# EAGLE design ai_breakout_tb6612fng (EAGLE 6.5.0)
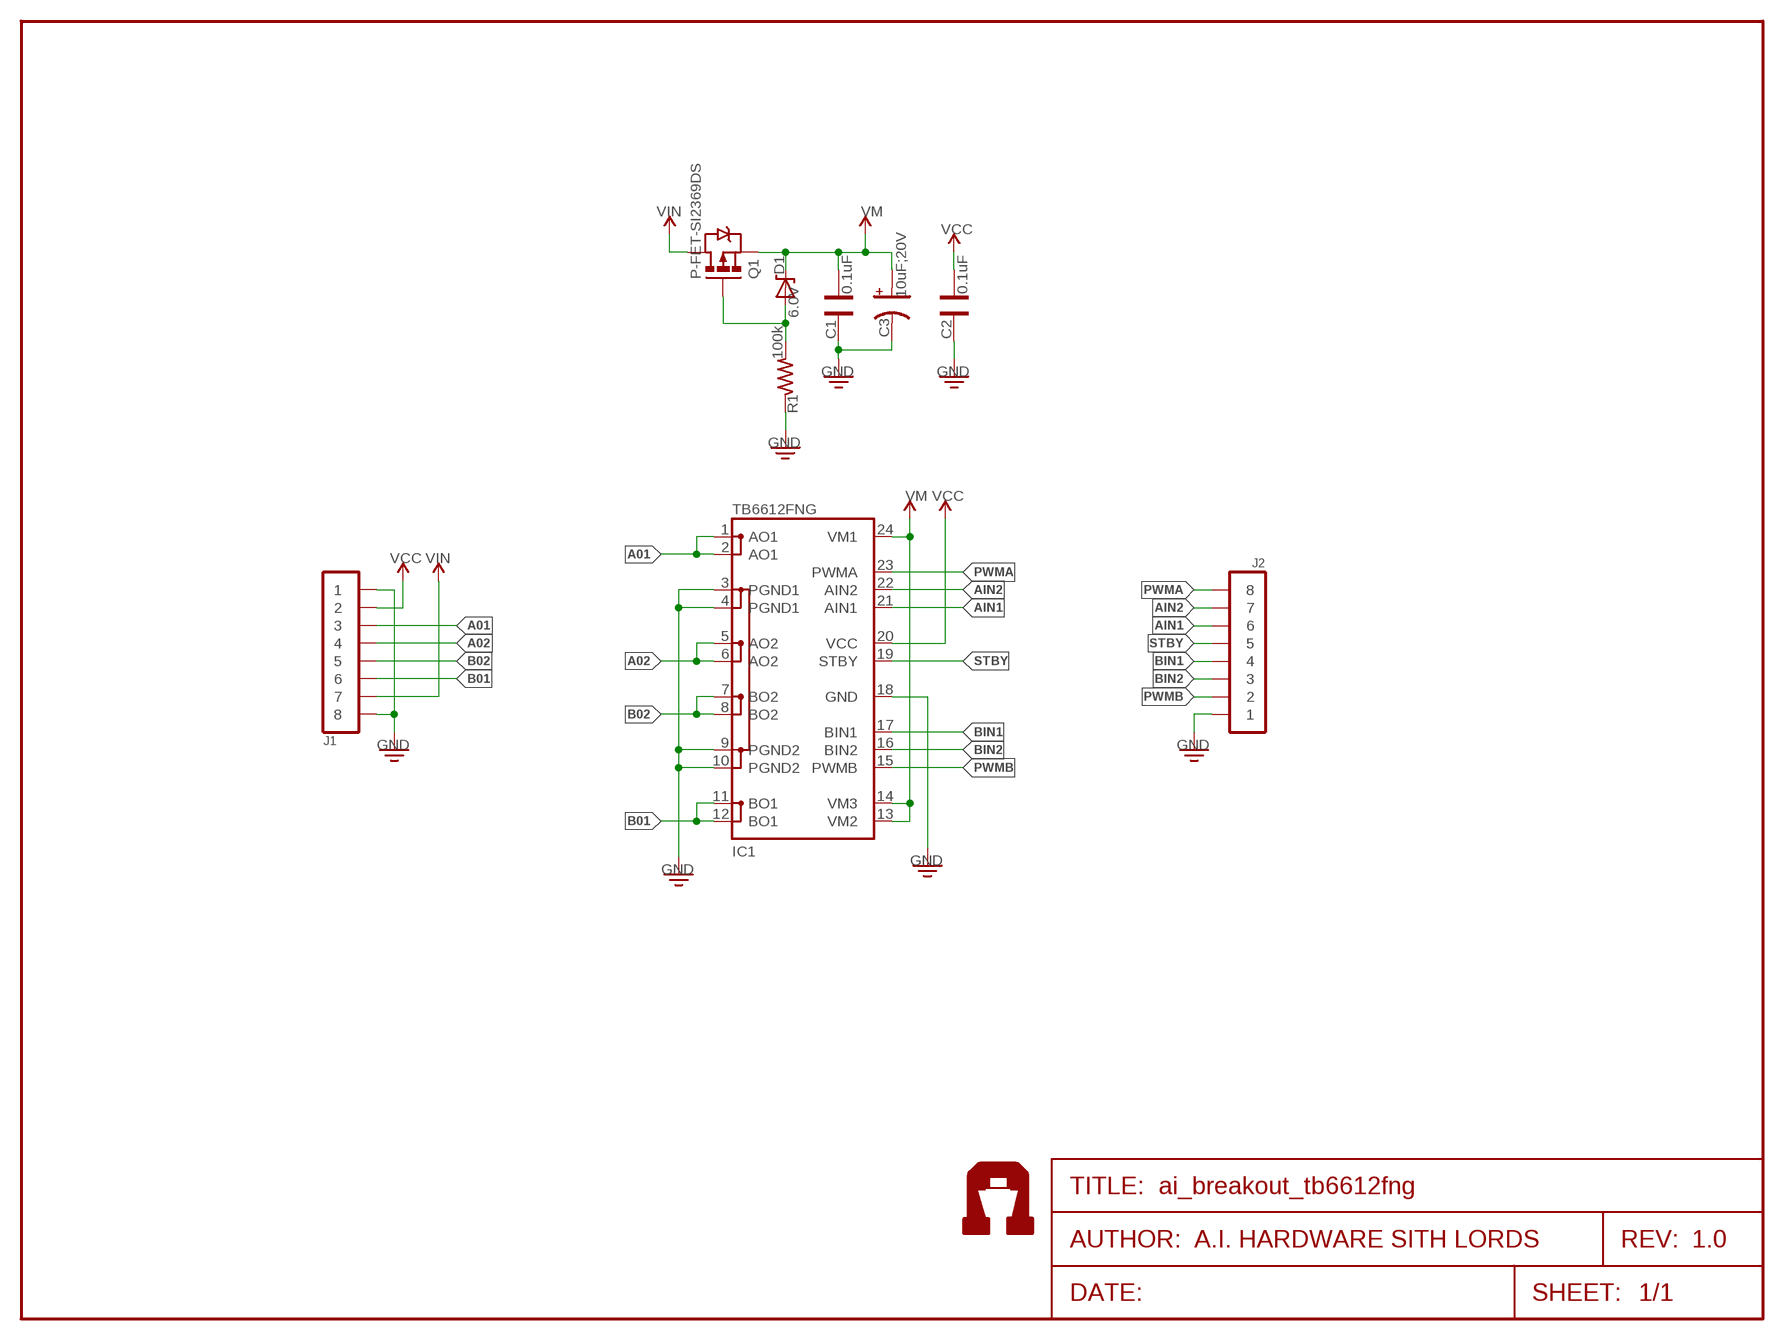
[diagram p0: schematic, sheet 1]
FRAME1 (FRAME-LETTER): AUTHOR: A.I. HARDWARE SITH LORDS; REV: 1.0

## Parts
C1  0.1uF  CAP0603  [CAP-0603]
C2  0.1uF  CAP0603  [CAP-0603]
C3  10uF;20V  CAP-POLEIA3216  [CAP-POL-EIA3216]
D1  6.0V  DIODE-ZENER-BZT52  [SOD-323]
IC1  TB6612FNG  [SSOP24]
J1  1X08  [1X08]
J2  1X08NOFIRST  [1X08-NOFIRST]
Q1  P-FET-SI2369DS  [SOT-23]
R1  100k  RES0603  [RES-0603]
U$5  AI-LOGOXS  [AI-LOGO-XS]

## Nets
A01: IC1.1(AO1) IC1.2(AO1) J1.3
A02: IC1.5(AO2) IC1.6(AO2) J1.4
AIN1: IC1.21(AIN1) J2.6
AIN2: IC1.22(AIN2) J2.7
B01: IC1.11(BO1) IC1.12(BO1) J1.6
B02: IC1.7(BO2) IC1.8(BO2) J1.5
BIN1: IC1.17(BIN1) J2.4
BIN2: IC1.16(BIN2) J2.3
GND: C1.2 C2.2 C3.C IC1.3(PGND1) IC1.4(PGND1) IC1.9(PGND2) IC1.10(PGND2) IC1.18(GND) J1.1 J1.8 J2.1 R1.1
N$1: D1.A Q1.1(G) R1.2
PWMA: IC1.23(PWMA) J2.8
PWMB: IC1.15(PWMB) J2.2
STBY: IC1.19(STBY) J2.5
VCC: C2.1 IC1.20(VCC) J1.2
VIN: J1.7 Q1.3(D)
VM: C1.1 C3.A D1.C IC1.13(VM2) IC1.14(VM3) IC1.24(VM1) Q1.2(S)

## Library data of the parts
C1 C2 = Ai_Passives:CAP
C3 = Ai_Passives:CAP-POL: Polarized Capacitor Normally 10uF, 47uF, and 100uF in electrolytic and tantalum varieties.
D1 = Ai_DiscreteSemis:DIODE-ZENER
IC1 = Ai_IC:TB6612FNG: TB6612FNG MOS dual H-bridge motor driver, 1.2A current 3.2A peak 3 or 5v logic and 3-15v motor
J1 J2 = Ai_Connectors:1X08
Q1 = Ai_DiscreteSemis:P-FET
R1 = Ai_Passives:RES: Part # blah Digikey
U$5 = Ai_Miscellany:AI-LOGO

## Board
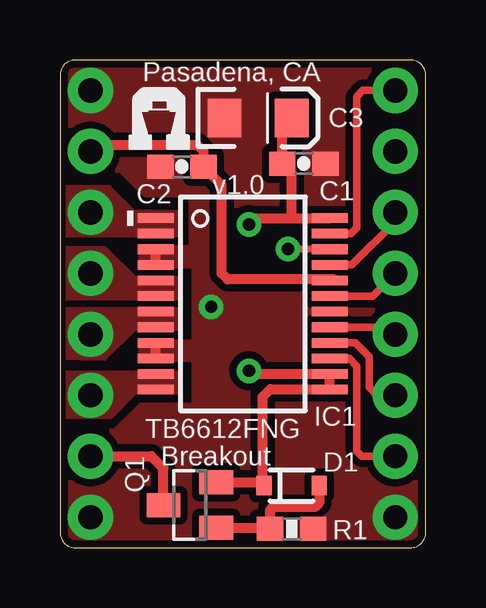
[diagram p1: board, top side]
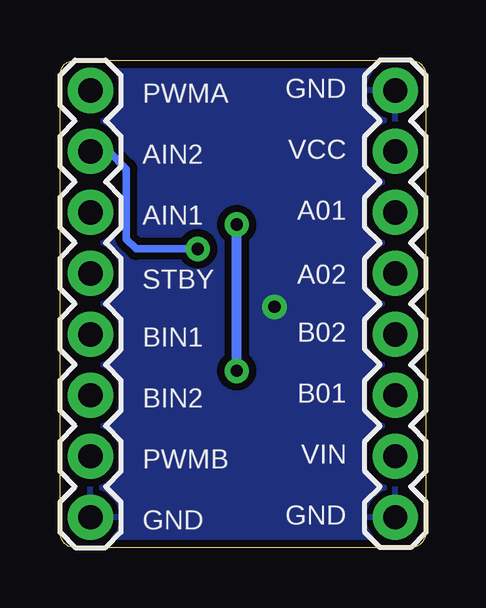
[diagram p2: board, bottom side, seen from below]

Size 15.24 x 20.32 mm. Coordinates in mm from the lower left corner, seen from the top.
Outline: 0,19.68 0,0.64 arc90 0.64,0 14.61,0 arc90 15.24,0.64 15.24,19.68 arc90 14.61,20.32 0.64,20.32 arc90 0,19.68
Copper layers (1*16): Top 0.035mm / dielectric 1.5mm / Bottom 0.035mm
Design rules "ai_2layer": minimum track width 7mil, minimum drill 15mil, track to track 8mil, track to pad 8mil, pad to pad 8mil, via to via 8mil, smd to smd 8mil, copper to edge 8mil, drill to drill 8mil, minimum pad ring 12mil, minimum via ring 10mil, stop-mask expansion 4mil, vias tented up to drill 20mil, thermal gap 10mil

### Footprints (pad centres in the part's own frame; a part is rotated, then mirrored left to right if it is on the bottom)
CAP-0603 = smd 1.1 x 1: 1 -0.9,0; 2 0.9,0
CAP-POL-EIA3216 = smd 1.4 x 1.6: A 1.4,0; C -1.4,0
SOD-323 = smd 0.63 x 0.83: A -1.15,0; C 1.15,0
SSOP24 = smd 0.4 x 1.5: 1 -3.575,-3.625; 2 -2.925,-3.625; 3 -2.275,-3.625; 4 -1.625,-3.625; 5 -0.975,-3.625; 6 -0.325,-3.625; 7 0.325,-3.625; 8 0.975,-3.625; 9 1.625,-3.625; 10 2.275,-3.625; 11 2.925,-3.625; 12 3.575,-3.625; 13 3.575,3.625; 14 2.925,3.625; 15 2.275,3.625; 16 1.625,3.625; 17 0.975,3.625; 18 0.325,3.625; 19 -0.325,3.625; 20 -0.975,3.625; 21 -1.625,3.625; 22 -2.275,3.625; 23 -2.925,3.625; 24 -3.575,3.625
1X08 = drill 1.016 pad 1.88: 1 -8.89,0; 2 -6.35,0; 3 -3.81,0; 4 -1.27,0; 5 1.27,0; 6 3.81,0; 7 6.35,0; 8 8.89,0
1X08-NOFIRST = drill 1.016 pad 1.88: 1 -8.89,0; 2 -6.35,0; 3 -3.81,0; 4 -1.27,0; 5 1.27,0; 6 3.81,0; 7 6.35,0; 8 8.89,0
SOT-23 = smd 1 x 1.4: 1 -0.95,-1.1; 2 0.95,-1.1; 3 0,1.1
RES-0603 = smd 1.1 x 1: 1 -0.9,0; 2 0.9,0

### Placement (x,y rotation side)
C1  10.16,16 0 top
C2  5.08,15.88 180 top
C3  8.26,17.91 0 top
D1  9.65,2.59 180 top
IC1  7.62,10.16 270 top
J1  1.27,10.16 270 bottom
J2  13.97,10.16 90 bottom
Q1  5.41,1.78 90 top
R1  9.65,0.79 180 top
U$5  2.79,16.51 0 top

### Tracks (layer width: path | path; a pad name or v marks a point on that pad's centre or on a via)
A01
  pour Top (no thermals): 4.85,13.94 3.05,13.97 2.03,14.99 0,14.99 0,13.06 4.83,13.06
A02
  pour Top (no thermals): 4.85,11.2 4.85,10.41 0,10.41 0,12.45 1.83,12.45 3.1,11.2
AIN1
  Top 0.305: IC1.21 12.17,11.79 13.97,13.59 J2.6
AIN2  (via drill 0.51)
  Top 0.305: IC1.22 10.55,12.44 v9.5,12.45
  Bottom 0.305: v9.5,12.45 12.06,12.45 12.47,12.85 12.47,15.77 13.21,16.51 J2.7
B01
  pour Top (no thermals): 0,7.26 4.85,7.26 4.88,6.5 3.12,6.5 2.11,5.49 0,5.49
B02
  pour Top (no thermals): 4.88,9.14 3.07,9.14 1.8,7.9 0,7.92 0,9.91 4.85,9.91
BIN1
  Top 0.305: IC1.17 13.68,9.19 J2.4
BIN2
  Top 0.305: J2.3 13.21,6.35 12.88,6.68 12.88,7.95 12.29,8.54 IC1.16
GND  (via drill 0.51)
  Top 0.406: IC1.10 IC1.9 | IC1.4 IC1.3
  other vias: 6.3,10.03
  pour Top (isolate 0.305, no thermals): 0,0 15.24,0 15.24,20.32 0,20.32 0,15.75 2.54,15.75 3.56,14.73 5.46,14.73 5.46,12.47 3.38,12.47 3.38,11.76 5.59,11.76 5.59,8.53 3.38,8.53 3.38,7.87 5.59,7.87 5.59,5.94 3.38,5.92 2.29,4.83 0,4.83
  pour Bottom (isolate 0.305): 0,0 15.24,0 15.24,20.32 0,20.32
N$1
  Top 0.406: D1.A 10.8,1.85 10.62,1.7 8.89,1.7 8.75,1.56 R1.2 8.71,0.83 Q1.1
PWMA
  Top 0.305: IC1.23 12.12,13.09 12.37,13.34 12.37,18.8 12.62,19.05 J2.8
PWMB
  Top 0.305: J2.2 12.57,3.81 12.37,4.01 12.37,7.57 12.05,7.88 IC1.15
STBY
  Top 0.305: IC1.19 13.03,10.48 J2.5
VCC
  Top 0.406: IC1.20 11.39,11.13 11.43,11.18 6.99,11.18 6.73,11.43 6.73,15.1 C2.1 5.97,16.54 5.71,16.79 1.52,16.79 J1.2
VIN
  Top 0.406: J1.7 3.81,3.81 4.31,3.31 Q1.3
VM  (via drill 0.51)
  Top 0.406: v7.87,7.37 8.01,7.24 IC1.14 IC1.13 11.23,6.6 8.76,6.6 8.44,6.28 8.44,2.65 D1.C 8.37,2.73 Q1.2 | v7.87,13.46 8.13,13.72 9.65,13.72 | 9.65,13.72 11.23,13.72 IC1.24 | 9.65,13.72 9.65,15.61 C1.1 9.26,17.51 C3.A
  Bottom 0.406: v7.87,7.37 v7.87,13.46

### Text on the board
tPlace: Pasadena, CA | v1.0 | TB6612FNG | Breakout
bPlace: GND | PWMA | VCC | AIN2 | A01 | AIN1 | A02 | STBY | B02 | BIN1 | B01 | BIN2 | VIN | PWMB | GND | GND